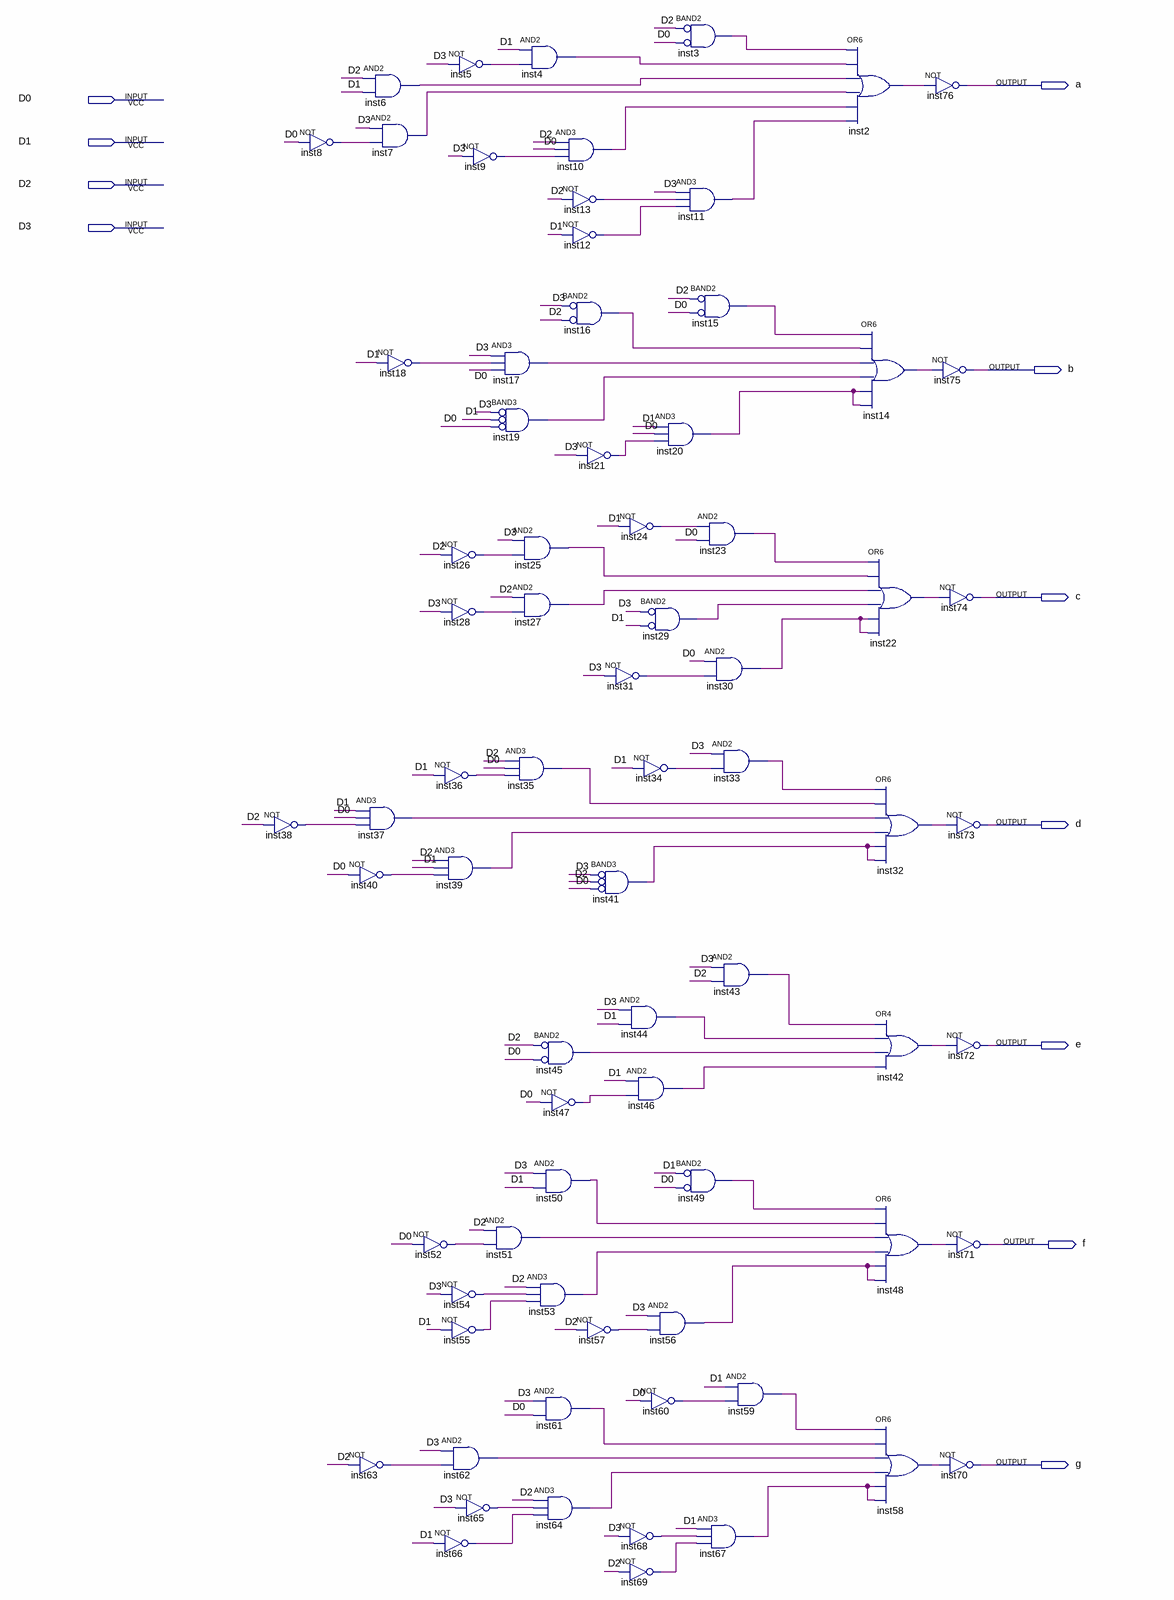
[diagram p0: schematic sheet]
// Quartus schematic display-7segment-binary.bdf as structural Verilog: 75 symbols, 11 pins
module \display-7segment-binary  (
  input  D0,
  input  D1,
  input  D2,
  input  D3,
  output a,
  output b,
  output c,
  output d,
  output e,
  output f,
  output g
);

  wire inst2_out, inst3_out, inst4_out, inst5_out, inst6_out, inst7_out, inst8_out, inst9_out, inst10_out,
       inst11_out, inst12_out, inst13_out, inst14_out, inst15_out, inst16_out, inst17_out, inst18_out,
       inst19_out, inst20_out, inst21_out, inst22_out, inst23_out, inst24_out, inst25_out, inst26_out,
       inst27_out, inst28_out, inst29_out, inst30_out, inst31_out, inst32_out, inst33_out, inst34_out,
       inst35_out, inst36_out, inst37_out, inst38_out, inst39_out, inst40_out, inst41_out, inst42_out,
       inst43_out, inst44_out, inst45_out, inst46_out, inst47_out, inst48_out, inst49_out, inst50_out,
       inst51_out, inst52_out, inst53_out, inst54_out, inst55_out, inst56_out, inst57_out, inst58_out,
       inst59_out, inst60_out, inst61_out, inst62_out, inst63_out, inst64_out, inst65_out, inst66_out,
       inst67_out, inst68_out, inst69_out;

  not inst8 (inst8_out, D0);
  not inst38 (inst38_out, D2);
  and inst6 (inst6_out, D2, D1);
  and inst37 (inst37_out, D1, D0, inst38_out);
  not inst40 (inst40_out, D0);
  not inst63 (inst63_out, D2);
  and inst7 (inst7_out, D3, inst8_out);
  not inst18 (inst18_out, D1);
  not inst52 (inst52_out, D0);
  not inst5 (inst5_out, D3);
  not inst9 (inst9_out, D3);
  not inst26 (inst26_out, D2);
  not inst28 (inst28_out, D3);
  not inst36 (inst36_out, D1);
  and inst39 (inst39_out, D2, D1, inst40_out);
  not inst54 (inst54_out, D3);
  not inst55 (inst55_out, D1);
  and inst62 (inst62_out, D3, inst63_out);
  not inst65 (inst65_out, D3);
  not inst66 (inst66_out, D1);
  and inst4 (inst4_out, D1, inst5_out);
  and inst17 (inst17_out, D3, inst18_out, D0);
  and inst19 (inst19_out, ~D3, ~D1, ~D0);  // BAND3
  and inst25 (inst25_out, D3, inst26_out);
  and inst27 (inst27_out, D2, inst28_out);
  and inst35 (inst35_out, D2, D0, inst36_out);
  and inst45 (inst45_out, ~D2, ~D0);  // BAND2
  and inst50 (inst50_out, D3, D1);
  and inst51 (inst51_out, D2, inst52_out);
  and inst53 (inst53_out, D2, inst54_out, inst55_out);
  and inst61 (inst61_out, D3, D0);
  and inst64 (inst64_out, D2, inst65_out, inst66_out);
  and inst10 (inst10_out, D2, D0, inst9_out);
  not inst13 (inst13_out, D2);
  not inst12 (inst12_out, D1);
  and inst16 (inst16_out, ~D3, ~D2);  // BAND2
  not inst21 (inst21_out, D3);
  and inst41 (inst41_out, ~D3, ~D2, ~D0);  // BAND3
  not inst47 (inst47_out, D0);
  not inst57 (inst57_out, D2);
  not inst24 (inst24_out, D1);
  and inst29 (inst29_out, ~D3, ~D1);  // BAND2
  not inst31 (inst31_out, D3);
  not inst34 (inst34_out, D1);
  and inst44 (inst44_out, D3, D1);
  and inst46 (inst46_out, D1, inst47_out);
  and inst56 (inst56_out, D3, inst57_out);
  not inst60 (inst60_out, D0);
  not inst68 (inst68_out, D3);
  not inst69 (inst69_out, D2);
  and inst3 (inst3_out, ~D2, ~D0);  // BAND2
  and inst11 (inst11_out, D3, inst13_out, inst12_out);
  and inst15 (inst15_out, ~D2, ~D0);  // BAND2
  and inst20 (inst20_out, D1, D0, inst21_out);
  and inst23 (inst23_out, inst24_out, D0);
  and inst30 (inst30_out, D0, inst31_out);
  and inst49 (inst49_out, ~D1, ~D0);  // BAND2
  and inst67 (inst67_out, D1, inst68_out, inst69_out);
  and inst33 (inst33_out, D3, inst34_out);
  and inst43 (inst43_out, D3, D2);
  and inst59 (inst59_out, D1, inst60_out);
  or inst2 (inst2_out, inst3_out, inst4_out, inst6_out, inst7_out, inst10_out, inst11_out);
  or inst14 (inst14_out, inst15_out, inst16_out, inst17_out, inst19_out, inst20_out, inst20_out);
  or inst22 (inst22_out, inst23_out, inst25_out, inst27_out, inst29_out, inst30_out, inst30_out);
  or inst32 (inst32_out, inst33_out, inst35_out, inst37_out, inst39_out, inst41_out, inst41_out);
  or inst42 (inst42_out, inst43_out, inst44_out, inst45_out, inst46_out);
  or inst48 (inst48_out, inst49_out, inst50_out, inst51_out, inst53_out, inst56_out, inst56_out);
  or inst58 (inst58_out, inst59_out, inst61_out, inst62_out, inst64_out, inst67_out, inst67_out);
  not inst76 (a, inst2_out);
  not inst75 (b, inst14_out);
  not inst74 (c, inst22_out);
  not inst73 (d, inst32_out);
  not inst72 (e, inst42_out);
  not inst71 (f, inst48_out);
  not inst70 (g, inst58_out);
endmodule
